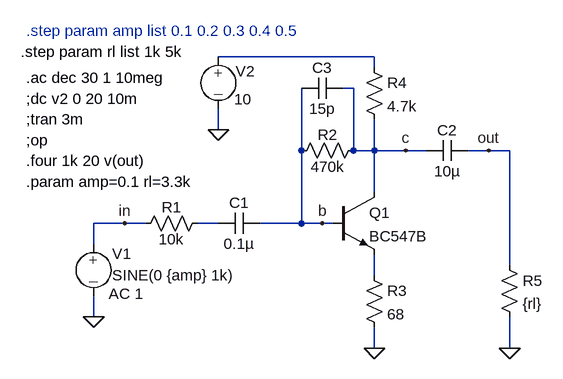
[diagram p0: schematic Transistor_verstaerker.asc]
Transistor_verstaerker.asc, the LTspice schematic file:
Version 4
SHEET 1 1044 680
WIRE 496 -112 256 -112
WIRE 496 -96 496 -112
WIRE 464 -64 448 -64
WIRE 256 0 256 -32
WIRE 384 32 384 -64
WIRE 464 32 464 -64
WIRE 496 32 496 -16
WIRE 496 32 464 32
WIRE 544 32 496 32
WIRE 576 32 544 32
WIRE 672 32 640 32
WIRE 704 32 672 32
WIRE 496 96 496 32
WIRE 112 144 64 144
WIRE 144 144 112 144
WIRE 256 144 224 144
WIRE 384 144 384 32
WIRE 384 144 320 144
WIRE 416 144 384 144
WIRE 432 144 416 144
WIRE 64 176 64 144
WIRE 704 208 704 32
WIRE 496 224 496 192
WIRE 64 288 64 256
WIRE 496 336 496 304
WIRE 704 336 704 288
FLAG 64 288 0
FLAG 496 336 0
FLAG 704 336 0
FLAG 672 32 out
FLAG 544 32 c
FLAG 416 144 b
FLAG 112 144 in
FLAG 256 0 0
SYMBOL Source-V 64 160 R0
WINDOW 0 29 31 Left 0
WINDOW 3 29 64 Left 0
WINDOW 123 23 92 Left 0
WINDOW 39 0 0 Left 0
SYMATTR InstName V1
SYMATTR Value SINE(0 {amp} 1k)
SYMATTR Value2 AC 1
SYMBOL res 128 160 R270
WINDOW 0 25 56 VTop 0
WINDOW 3 7 56 VBottom 0
SYMATTR InstName R1
SYMATTR Value 10k
SYMBOL cap 256 160 R270
WINDOW 0 32 32 VTop 0
WINDOW 3 0 32 VBottom 0
SYMATTR InstName C1
SYMATTR Value 0.1µ
SYMBOL res 480 16 R90
WINDOW 0 7 56 VBottom 0
WINDOW 3 25 56 VTop 0
SYMATTR InstName R2
SYMATTR Value 470k
SYMBOL npn 432 96 R0
SYMATTR InstName Q1
SYMATTR Value BC547B
SYMBOL res 480 208 R0
SYMATTR InstName R3
SYMATTR Value 68
SYMBOL res 480 -112 R0
SYMATTR InstName R4
SYMATTR Value 4.7k
SYMBOL cap 576 48 R270
WINDOW 0 32 32 VTop 0
WINDOW 3 0 32 VBottom 0
SYMATTR InstName C2
SYMATTR Value 10µ
SYMBOL res 688 192 R0
SYMATTR InstName R5
SYMATTR Value {rl}
SYMBOL Source-V 256 -128 R0
WINDOW 0 27 38 Left 0
WINDOW 3 24 81 Left 0
WINDOW 123 0 0 Left 0
WINDOW 39 0 0 Left 0
SYMATTR InstName V2
SYMATTR Value 10
SYMBOL cap 448 -80 R90
WINDOW 0 0 32 VBottom 0
WINDOW 3 32 32 VTop 0
SYMATTR InstName C3
SYMATTR Value 15p
TEXT -40 16 Left 0 !;op
TEXT -40 -48 Left 0 !;dc v2 0 20 10m
TEXT -40 -80 Left 0 !.ac dec 30 1 10meg
TEXT -40 -16 Left 0 !;tran 3m
TEXT -40 48 Left 0 !.four 1k 20 v(out)
TEXT -40 -152 Left 0 ;.step param amp list 0.1 0.2 0.3 0.4 0.5
TEXT -40 80 Left 0 !.param amp=0.1 rl=3.3k
TEXT -48 -120 Left 0 !.step param rl list 1k 5k

The netlist it stands for:
* Transistor_verstaerker.asc
V1 in 0 SINE(0 {amp} 1k) AC 1
R1 in N002 10k
C1 N002 b 0.1µ
R2 c b 470k
Q1 c b N003 0 BC547B
R3 N003 0 68
R4 N001 c 4.7k
C2 c out 10µ
R5 out 0 {rl}
V2 N001 0 10
C3 c b 15p
.model NPN NPN
.model PNP PNP
.lib standard.bjt
;op
;dc v2 0 20 10m
.ac dec 30 1 10meg
;tran 3m
.four 1k 20 v(out)
* .step param amp list 0.1 0.2 0.3 0.4 0.5
.param amp=0.1 rl=3.3k
.step param rl list 1k 5k
.backanno
.end